# EAGLE design working (EAGLE 9.2.0)
COMPANY: ADAFRUIT INDUSTRIES; DRAWN: KTOWN; REV: A; YEAR: 2018
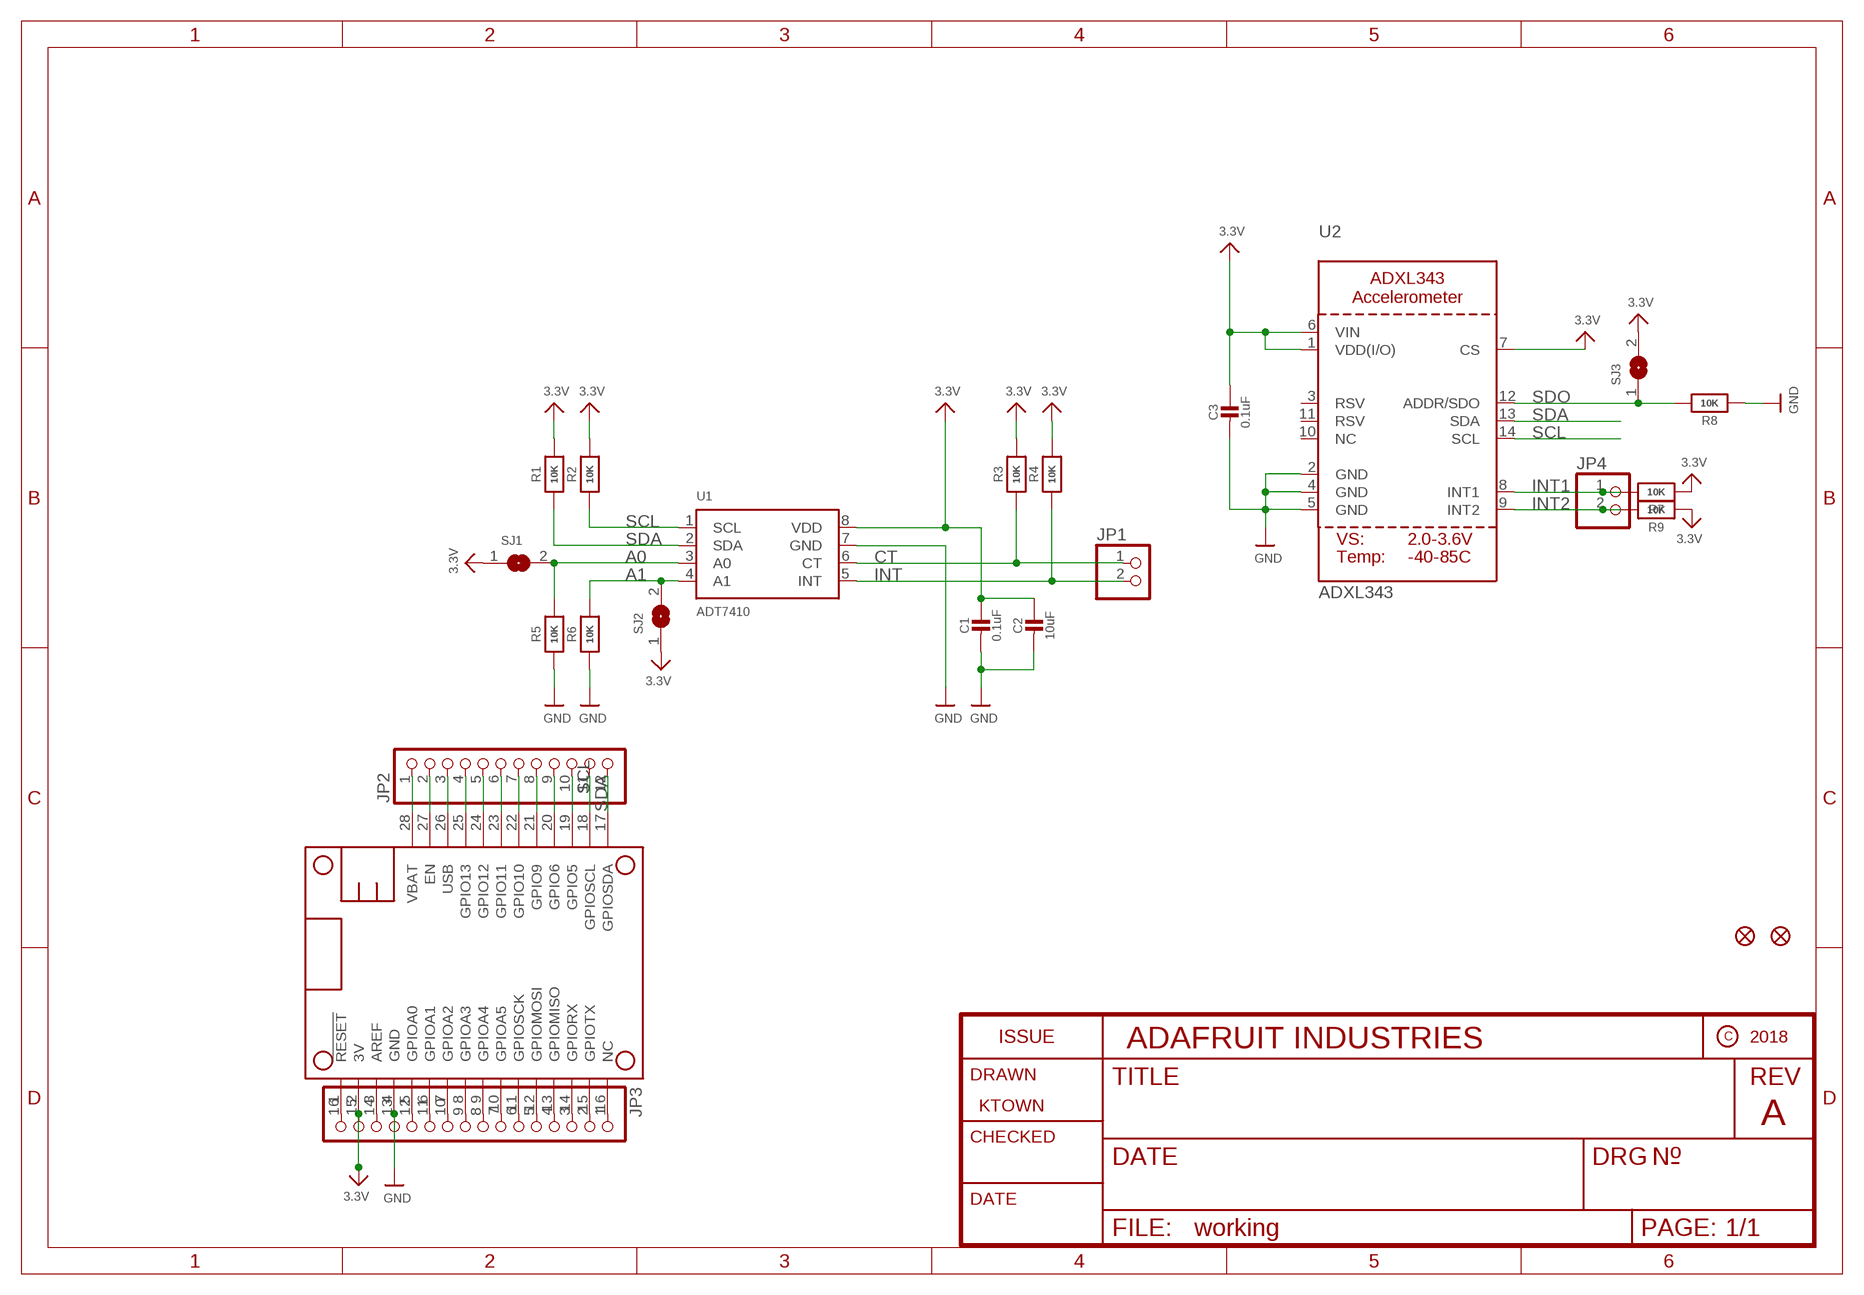
[diagram p0: schematic, sheet 1]

## Parts
C1  0.1uF  CAP_CERAMIC0603_NO  [0603-NO]
C2  10uF  CAP_CERAMIC0805-NOOUTLINE  [0805-NO]
C3  0.1uF  CAP_CERAMIC0603_NO  [0603-NO]
FID1  FIDUCIAL_1MM  [FIDUCIAL_1MM]
FID2  FIDUCIAL_1MM  [FIDUCIAL_1MM]
JP1  HEADER-1X2ROUND  [1X02_ROUND]
JP2  HEADER-1X1276MIL  [1X12_ROUND_76MIL]
JP3  HEADER-1X16_76MIL  [1X16_ROUND_76MIL]
JP4  HEADER-1X2ROUND  [1X02_ROUND]
MS1  FEATHERWING  [FEATHERWING]
R1  10K  RESISTOR_0603_NOOUT  [0603-NO]
R2  10K  RESISTOR_0603_NOOUT  [0603-NO]
R3  10K  RESISTOR_0603_NOOUT  [0603-NO]
R4  10K  RESISTOR_0603_NOOUT  [0603-NO]
R5  10K  RESISTOR_0603_NOOUT  [0603-NO]
R6  10K  RESISTOR_0603_NOOUT  [0603-NO]
R7  10K  RESISTOR_0603_NOOUT  [0603-NO]
R8  10K  RESISTOR_0603_NOOUT  [0603-NO]
R9  10K  RESISTOR_0603_NOOUT  [0603-NO]
SJ1  SOLDERJUMPER  [SOLDERJUMPER_ARROW_NOPASTE]
SJ2  SOLDERJUMPER  [SOLDERJUMPER_ARROW_NOPASTE]
SJ3  SOLDERJUMPER  [SOLDERJUMPER_ARROW_NOPASTE]
U1  ADT7410  TEMP_ADT7410  [SOIC8_150MIL]
U2  ADXL343  ACCEL_ADXL343  [LGA14]

## Nets
3.3V: C1.1 C2.1 C3.1 JP3.15 MS1.2(3V) R1.2 R2.2 R3.2 R4.2 R7.1 R9.1 SJ1.1 SJ2.1 SJ3.2 U1.8(VDD) U2.1(VDD(I/O)) U2.6(VIN) U2.7(CS)
A0: R5.2 SJ1.2 U1.3(A0)
A1: R6.2 SJ2.2 U1.4(A1)
CT: JP1.1 R3.1 U1.6(CT)
GND: C1.2 C2.2 C3.2 JP3.13 MS1.4(GND) R5.1 R6.1 R8.1 U1.7(GND) U2.2(GND) U2.4(GND) U2.5(GND)
INT: JP1.2 R4.1 U1.5(INT)
INT1: JP4.1 R7.2 U2.8(INT1)
INT2: JP4.2 R9.2 U2.9(INT2)
N$1: JP2.2 MS1.27(EN)
N$2: JP2.4 MS1.25(GPIO13)
N$3: JP2.5 MS1.24(GPIO12)
N$4: JP2.6 MS1.23(GPIO11)
N$5: JP2.7 MS1.22(GPIO10)
N$6: JP2.8 MS1.21(GPIO9)
N$7: JP2.9 MS1.20(GPIO6)
N$8: JP2.10 MS1.19(GPIO5)
N$11: JP3.1 MS1.16(NC)
N$12: JP3.2 MS1.15(GPIOTX)
N$13: JP3.3 MS1.14(GPIORX)
N$14: JP3.4 MS1.13(GPIOMISO)
N$15: JP3.5 MS1.12(GPIOMOSI)
N$16: JP3.6 MS1.11(GPIOSCK)
N$17: JP3.7 MS1.10(GPIOA5)
N$18: JP3.8 MS1.9(GPIOA4)
N$19: JP3.9 MS1.8(GPIOA3)
N$20: JP3.10 MS1.7(GPIOA2)
N$21: JP3.11 MS1.6(GPIOA1)
N$22: JP3.12 MS1.5(GPIOA0)
N$24: JP3.14 MS1.3(AREF)
N$25: JP3.16 MS1.1(!RESET)
SCL: JP2.11 MS1.18(GPIOSCL) R2.1 U1.1(SCL) U2.14(SCL)
SDA: JP2.12 MS1.17(GPIOSDA) R1.1 U1.2(SDA) U2.13(SDA)
SDO: R8.2 SJ3.1 U2.12(ADDR/SDO)
USB: JP2.3 MS1.26(USB)
VBAT: JP2.1 MS1.28(VBAT)
Unconnected: U2.3(RSV) U2.10(NC) U2.11(RSV)

## Library data of the parts
C1-C3 = microbuilder:CAP_CERAMIC: Ceramic Capacitors For new designs, use the packages preceded by an '_' character since they are more reliable: The following footprints should be used on most boards: _0402 - Standard footprint for regular board layouts _0603 - Standard footprint for regular board layouts _0805 - Standard footprint for regular board layouts _1206 - Standard footprint for regular board layouts For extremely tight-pitch boards where space is at a premium, the following 'micro-pitch' footprints can be used (smaller pads, no silkscreen outline, etc.): _0402MP - Micro-pitch footprint for very dense/compact boards _0603MP - Micro-pitch footprint for very dense/compact boards _0805MP - Micro-pitch footprint for very dense/compact boards _1206MP - Micro-pitch footprint for very dense/compact boards
FID1 FID2 = microbuilder:FIDUCIAL: Fiducial Alignment Points Various fiducial points for machine vision alignment.; BOM: EXCLUDE
JP1 JP4 = microbuilder:HEADER-1X2: PIN HEADER
JP2 = microbuilder:HEADER-1X12
JP3 = microbuilder:HEADER-1X16: PIN HEADER
MS1 = microbuilder:FEATHERWING
R1-R9 = microbuilder:RESISTOR: Resistors For new designs, use the packages preceded by an '_' character since they are more reliable: The following footprints should be used on most boards: _0402 - Standard footprint for regular board layouts _0603 - Standard footprint for regular board layouts _0805 - Standard footprint for regular board layouts _1206 - Standard footprint for regular board layouts For extremely tight-pitch boards where space is at a premium, the following 'micro-pitch' footprints can be used (smaller pads, no silkscreen outline, etc.): _0402MP - Micro-pitch footprint for very dense/compact boards _0603MP - Micro-pitch footprint for very dense/compact boards _0805MP - Micro-pitch footprint for very dense/compact boards _1206MP - Micro-pitch footprint for very dense/compact boards
SJ1-SJ3 = microbuilder:SOLDERJUMPER: SMD Solder JUMPER Solder the two pads together to create a connection, or remove the solder to break it. REFLOW - Use this footprint for solder paste and reflow ovens. WAVE - Use this footprint for hand-soldering (larger pads). CLOSED - Has a trace between the two pads to ensure it is closed by default. The trace needs to be cut to disable the jumper, and can be closed again by creating a solder bridge between the two pads.; BOM: EXCLUDE
U1 = microbuilder:TEMP_ADT7410: ADT7410 - 13-bit 0.5°C I2C Temperature Sensor Operating Voltage: 2.7-5.5V Temperature Range: -55°C-150°C Accuracy: 0.5°C from -40°C-105°C Shutdown Current: 2uA (3.3V) Typical Operating Current (1 Sample/s): 46uA (3.3V) Digikey: ADT7410TRZ-ND
U2 = microbuilder:ACCEL_ADXL343: ADXL343 - Digital Accelerometer 2/4/8/16g

## Board
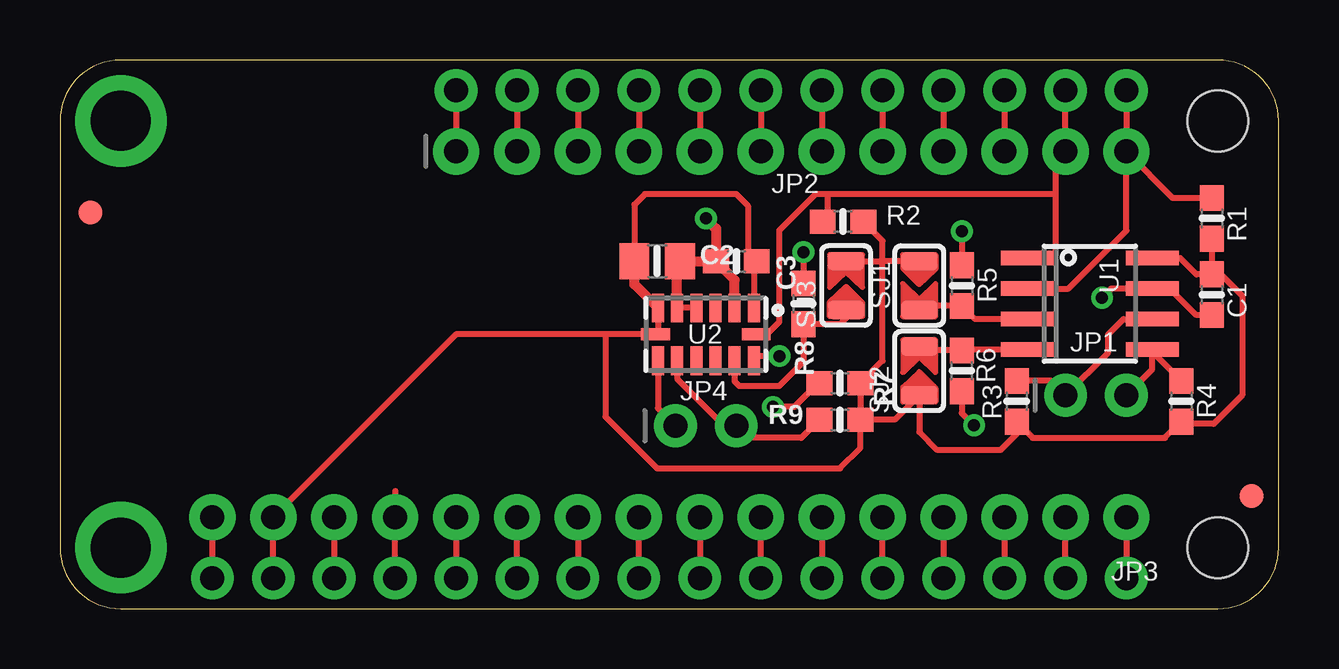
[diagram p1: board, top side]
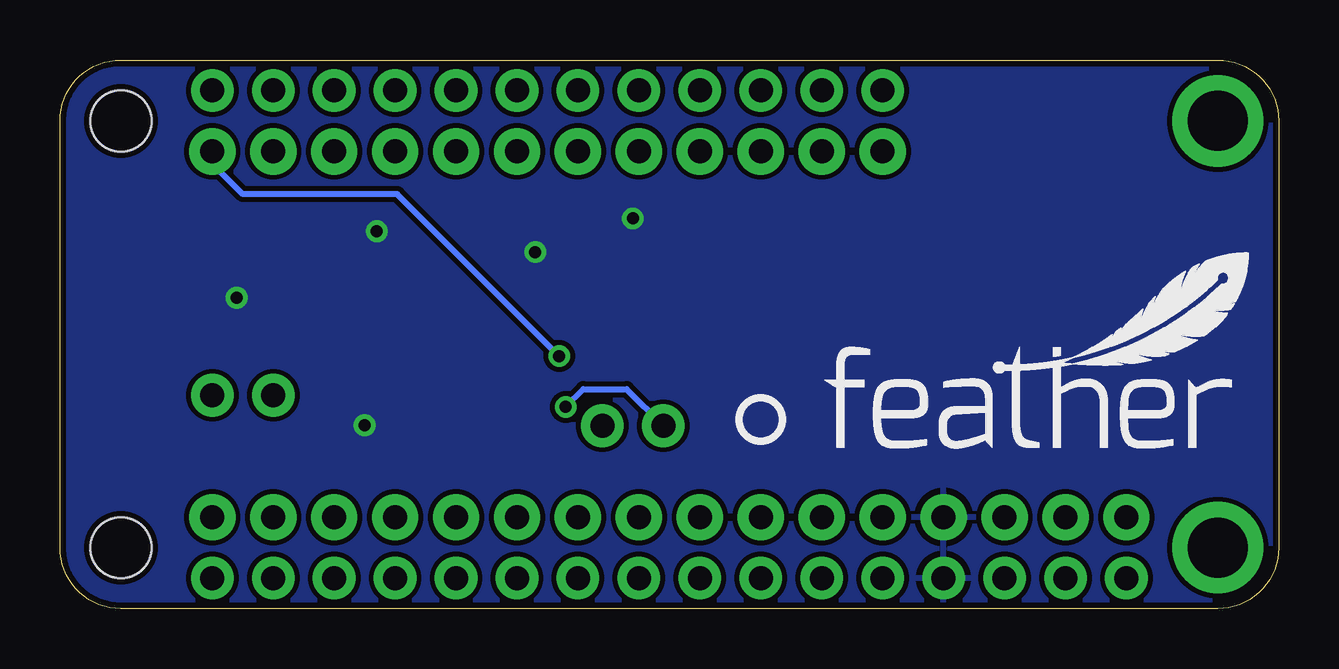
[diagram p2: board, bottom side, seen from below]

Size 50.8 x 22.86 mm. Coordinates in mm from the lower left corner, seen from the top.
Copper layers (1*16): Top 0.035mm / dielectric 1.5mm / Bottom 0.035mm
Design rules "adafruit": minimum track width 8mil, minimum drill 15.5mil, track to track 8mil, track to pad 8mil, pad to pad 8mil, via to via 8mil, smd to smd 8mil, copper to edge 10mil, drill to drill 8mil, minimum pad ring 10mil, minimum via ring 8mil, stop-mask expansion 2mil, vias tented up to drill 20mil, thermal gap 10mil

### Footprints (pad centres in the part's own frame; a part is rotated, then mirrored left to right if it is on the bottom)
0603-NO = smd 1.075 x 1: 1 -0.85,0; 2 0.85,0
0805-NO = smd 1.24 x 1.5: 1 -0.95,0; 2 0.95,0
FIDUCIAL_1MM = smd 1 x 1: 1 0,0
1X02_ROUND = drill 1 pad 1.778: 1 -1.27,0; 2 1.27,0
1X12_ROUND_76MIL = drill 1 pad 1.93: 1 -13.97,0; 2 -11.43,0; 3 -8.89,0; 4 -6.35,0; 5 -3.81,0; 6 -1.27,0; 7 1.27,0; 8 3.81,0; 9 6.35,0; 10 8.89,0; 11 11.43,0; 12 13.97,0
1X16_ROUND_76MIL = drill 1 pad 1.93: 1 -19.05,0; 2 -16.51,0; 3 -13.97,0; 4 -11.43,0; 5 -8.89,0; 6 -6.35,0; 7 -3.81,0; 8 -1.27,0; 9 1.27,0; 10 3.81,0; 11 6.35,0; 12 8.89,0; 13 11.43,0; 14 13.97,0; 15 16.51,0; 16 19.05,0
FEATHERWING = drill 1 pad 1.778: 1 6.35,1.27; 2 8.89,1.27; 3 11.43,1.27; 4 13.97,1.27; 5 16.51,1.27; 6 19.05,1.27; 7 21.59,1.27; 8 24.13,1.27; 9 26.67,1.27; 10 29.21,1.27; 11 31.75,1.27; 12 34.29,1.27; 13 36.83,1.27; 14 39.37,1.27; 15 41.91,1.27; 16 44.45,1.27; 17 44.45,21.59; 18 41.91,21.59; 19 39.37,21.59; 20 36.83,21.59; 21 34.29,21.59; 22 31.75,21.59; 23 29.21,21.59; 24 26.67,21.59; 25 24.13,21.59; 26 21.59,21.59; 27 19.05,21.59; 28 16.51,21.59 | drill 2.5 pad 3.81: P$1 2.54,20.32; P$2 2.54,2.54 | hole 2.54: 48.26,20.32; 48.26,2.54
SOLDERJUMPER_ARROW_NOPASTE = smd 0.762 x 1.524: 1 -1.016,0; 2 1.016,0
SOIC8_150MIL = smd 0.6 x 2.2: 1 -1.905,-2.6; 2 -0.635,-2.6; 3 0.635,-2.6; 4 1.905,-2.6; 5 1.905,2.6; 6 0.635,2.6; 7 -0.635,2.6; 8 -1.905,2.6
LGA14 = smd 0.5 x 1.2: 1 2,1.1; 2 1.2,1.1; 3 0.4,1.1; 4 -0.4,1.1; 5 -1.2,1.1; 6 -2,1.1; 8 -2,-1.1; 9 -1.2,-1.1; 10 -0.4,-1.1; 11 0.4,-1.1; 12 1.2,-1.1; 13 2,-1.1 | smd 1.2 x 0.5: 7 -2.1,0; 14 2.1,0

### Placement (x,y rotation side)
C1  48.01,13.08 270 top
C2  24.89,14.48 0 top
C3  28.19,14.48 180 top
FID1  1.27,16.51 0 top
FID2  49.66,4.7 0 top
JP1  43.18,8.89 0 top
JP2  30.48,19.05 0 top
JP3  25.4,3.81 180 top
JP4  26.92,7.62 0 top
MS1  0,0 0 top
R1  48.01,16.26 270 top
R2  32.64,16.13 0 top
R3  39.88,8.64 270 top
R4  46.74,8.64 270 top
R5  37.59,13.46 270 top
R6  37.59,9.91 90 top
R7  32.51,9.4 180 top
R8  30.99,12.7 270 top
R9  32.51,7.87 180 top
SJ1  35.81,13.46 270 top
SJ2  35.81,9.91 90 top
SJ3  32.77,13.46 90 top
U1  42.93,12.7 270 top
U2  26.92,11.43 0 top
U$1  [PCBFEAT-REV-040]  21.59,7.87 0 bottom
U$23  [FEATHERLOGO_MED]  19.05,6.6 0 bottom
U$24  [ADIWING_TOP]  0,0 0 top

### Tracks (layer width: path | path; a pad name or v marks a point on that pad's centre or on a via)
3.3V
  Top 0.254: MS1.2 JP3.15 16.51,11.43 22.73,11.43 | 46.65,7.7 46.06,7.11 40.55,7.11 R3.2 39.88,7.28 39.2,6.6 36.58,6.6 35.81,7.37 SJ2.1 34.8,7.87 R9.1 | 46.65,7.7 R4.2 | U1.8 46.7,14.61 47.37,13.93 C1.1 | C1.1 48.39,13.93 49.28,13.04 49.28,8.89 48.09,7.7 46.65,7.7 | U2.1 28.92,14.36 C3.1 28.67,14.85 28.67,16.8 28.19,17.27 24.38,17.27 23.94,16.83 23.94,14.73 C2.1 | U2.6 24.92,11.53 U2.7 22.73,11.43 | R1.2 C1.1 | R9.1 R7.1 34.29,10.33 34.29,14.48 | 34.29,14.48 34.29,15.33 R2.2 | SJ3.2 34.29,14.48 | SJ1.1 34.29,14.48 | 22.73,11.43 22.73,8 24.89,5.84 32.51,5.84 33.36,6.69 R9.1
  Top 0.406: U2.6 23.94,13.51 23.94,14.73
A0
  Top 0.254: U1.3 38.14,12.06 R5.2 35.98,12.61 SJ1.2
A1
  Top 0.254: U1.4 37.63,10.79 R6.2 35.98,10.76 SJ2.2
CT
  Top 0.254: R3.1 41.31,9.49 JP1.1 43.69,10.67 43.69,11.43 44.32,12.06 U1.6
GND  (via drill 0.5)
  Top 0.254: MS1.4 JP3.13 13.97,4.89 | C1.2 47.37,12.23 46.27,13.34 U1.7 43.81,13.34 v43.43,12.95 | R5.1 v37.59,15.72 | R6.1 37.59,8.15 v38.1,7.64 | v30.99,14.86 R8.1 | U2.4 | U2.4 26.42,12.53 | U2.4 26.42,12.53 | 26.42,12.53 U2.5 | 25.59,14.48 25.91,14.48
  Top 0.406: U2.5 25.72,14.29 25.91,14.48 | 25.59,14.48 C2.2 C3.2 | v26.92,16.26 27.34,15.84 C3.2 | U2.2 28.12,13.7 C3.2
  pour Bottom: 0,22.86 50.8,22.86 50.8,0 0,0
INT
  Top 0.254: R4.1 45.53,10.7 U1.5 45.53,9.97 JP1.2
INT1  (via drill 0.5)
  Top 0.254: U2.8 24.92,8.35 JP4.1 | v29.72,8.4 30.61,8.4 31.6,9.4 R7.2
  Bottom 0.254: JP4.1 27.18,9.14 28.98,9.14 v29.72,8.4
INT2
  Top 0.254: U2.9 25.72,9.58 27.69,7.62 JP4.2 28.7,7.11 30.9,7.11 R9.2 | R9.2
N$1
  Top 0.254: MS1.27 JP2.2
N$2
  Top 0.254: MS1.25 JP2.4
N$3
  Top 0.254: MS1.24 JP2.5
N$4
  Top 0.254: MS1.23 JP2.6
N$5
  Top 0.254: MS1.22 JP2.7
N$6
  Top 0.254: MS1.21 JP2.8
N$7
  Top 0.254: MS1.20 JP2.9
N$8
  Top 0.254: MS1.19 JP2.10
N$11
  Top 0.254: JP3.1 MS1.16
N$12
  Top 0.254: MS1.15 JP3.2
N$13
  Top 0.254: JP3.3 MS1.14
N$14
  Top 0.254: JP3.4 MS1.13
N$15
  Top 0.254: MS1.12 JP3.5
N$16
  Top 0.254: JP3.6 MS1.11
N$17
  Top 0.254: MS1.10 JP3.7
N$18
  Top 0.254: JP3.8 MS1.9
N$19
  Top 0.254: MS1.8 JP3.9
N$20
  Top 0.254: JP3.10 MS1.7
N$21
  Top 0.254: MS1.6 JP3.11
N$22
  Top 0.254: JP3.12 MS1.5
N$24
  Top 0.254: JP3.14 MS1.3
N$25
  Top 0.254: JP3.16 6.35,2.03 6.1,1.78 6.1,1.52 MS1.1
SCL
  Top 0.254: MS1.18 JP2.11 41.49,18.63 41.49,17.27 | 41.49,17.27 41.49,14.82 41.27,14.61 U1.1 | U2.14 29.46,11.43 29.97,11.94 29.97,15.75 31.5,17.27 32,17.27 | 41.49,17.27 32,17.27 | R2.1 32,16.34 32,17.27
SDA  (via drill 0.5)
  Top 0.254: MS1.17 JP2.12 | U1.2 42.04,13.34 44.45,15.75 JP2.12 | U2.13 29.12,10.52 v29.99,10.52 | R1.1 46.39,17.11 JP2.12
  Bottom 0.254: v29.99,10.52 36.74,17.27 43.18,17.27 44.45,18.54 JP2.12
SDO
  Top 0.254: SJ3.1 32.77,12.1 32.51,11.85 R8.2 30.99,10.29 29.97,9.27 28.32,9.27 28.12,9.47 U2.12
USB
  Top 0.254: MS1.26 JP2.3
VBAT
  Top 0.254: MS1.28 JP2.1